# Altium schematic sheet PoE_Si3404.SchDoc: =project_title (part 3 of 3)
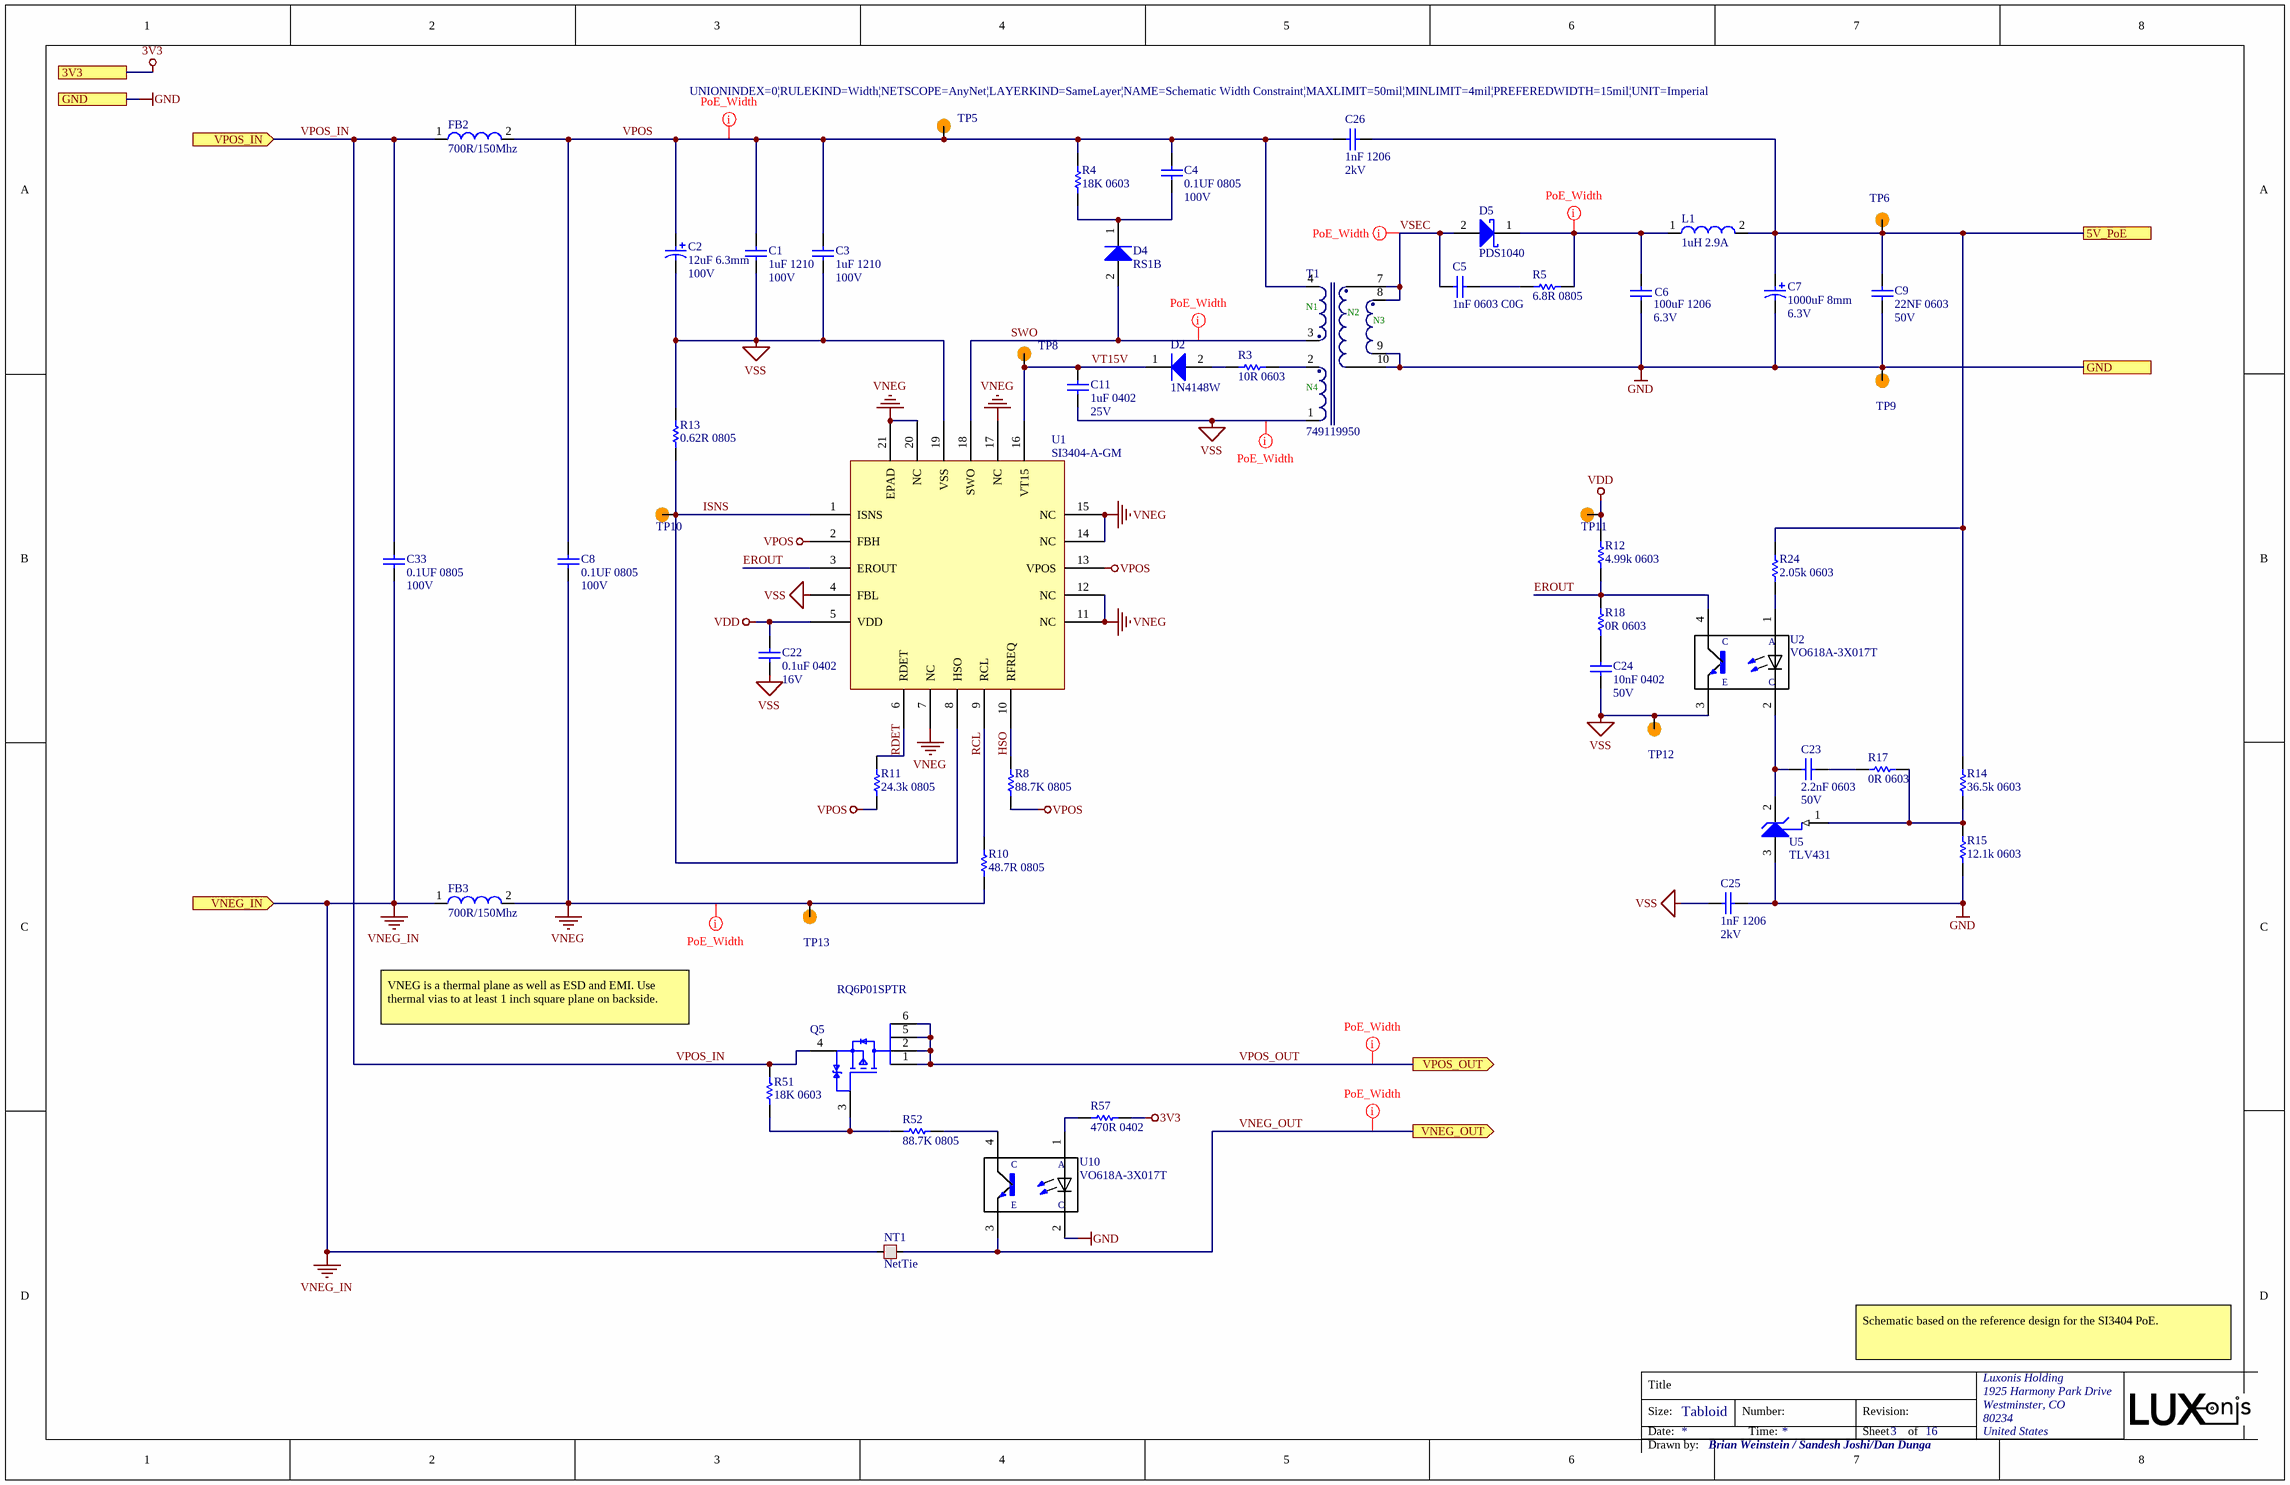
[diagram p2: PoE_Si3404.SchDoc]

## Library data of the parts (continued)
R11 = CRCW080524K3FKEA: RES SMD 24.3K OHM 1% 1/8W 0805; Manufacturer 1: Vishay; Resistance: 24.3kR; Temperature Coefficient: 100ppm/°C; Power Rating: 125mW; Voltage Rating: 150V; Supplier 1: Digi-Key; Manufacturer Part Number 1: CRCW080524K3FKEA; Stock 1: 7150; Pricing 1: 1=0.10000, 10=0.06200, 100=0.02540, 1000=0.01142, 2500=0.00991 (USD); RoHS: Yes; Mount: Surface Mount; Case/Package: 0805; Number of Pins: 2; Weight: 0.000194oz; Contact Plating: Tin; Case Code (Imperial): 0805; Case Code (Metric): 2012; Min Operating Temperature: -55°C; Max Operating Temperature: 155°C; Tolerance: 1%; Packaging: Tape and Reel; Composition: Thick Film; Package Quantity: 10; Termination: SMD/SMT; Number of Terminations: 2; Max Power Dissipation: 125mW; Features: Automotive AEC-Q200; Military Standard: Not; Voltage Rating (DC): 150V; Working Voltage: 150V; Length: 2mm; Height: 0.45mm; Width: 1.25mm; Depth: 1.25mm; Radiation Hardening: No; Lead Free: Lead Free; REACH SVHC: Unknown; ComponentLink1URL: https://datasheet.ciiva.com/11811/0900766b80d98b26-11811485.pdf?src-supplier=RSComponents; ComponentLink1Description: https://datasheet.ciiva.com/11811/0900766b80d98b26-11811485.pdf?src-supplier=RSComponents; ComponentLink2URL: https://datasheet.ciiva.com/5544/dcrcwe3-109170-5544277.pdf?src-supplier=Mouser; ComponentLink2Description: https://datasheet.ciiva.com/5544/dcrcwe3-109170-5544277.pdf?src-supplier=Mouser; ComponentLink3URL: https://datasheet.ciiva.com/2467/dcrcwe3-2467350.pdf?src-supplier=Digi-Key; ComponentLink3Description: https://datasheet.ciiva.com/2467/dcrcwe3-2467350.pdf?src-supplier=Digi-Key; ComponentLink4URL: https://datasheet.ciiva.com/3258/dcrcwe3-3258365.pdf?src-supplier=Avnet; ComponentLink4Description: https://datasheet.ciiva.com/3258/dcrcwe3-3258365.pdf?src-supplier=Avnet; ComponentLink5URL: https://datasheet.ciiva.com/2467/dcrcwe3-2467351.pdf?src-supplier=Digi-Key; ComponentLink5Description: https://datasheet.ciiva.com/2467/dcrcwe3-2467351.pdf?src-supplier=Digi-Key; ComponentLink6URL: https://datasheet.ciiva.com/2467/dcrcwe3-2467352.pdf?src-supplier=Digi-Key; ComponentLink6Description: https://datasheet.ciiva.com/2467/dcrcwe3-2467352.pdf?src-supplier=Digi-Key; ComponentLink7URL: https://datasheet.ciiva.com/22872/70201119-22872331.pdf?src-supplier=Allied+Electronics; ComponentLink7Description: https://datasheet.ciiva.com/22872/70201119-22872331.pdf?src-supplier=Allied+Electronics; ComponentLink8URL: https://datasheet.ciiva.com/3258/dcrcwe3-3258364.pdf?src-supplier=Avnet; ComponentLink8Description: https://datasheet.ciiva.com/3258/dcrcwe3-3258364.pdf?src-supplier=Avnet; ComponentLink9URL: https://datasheet.ciiva.com/17183/dcrcwe3-17183388.pdf?src-supplier=Avnet+Europe; ComponentLink9Description: https://datasheet.ciiva.com/17183/dcrcwe3-17183388.pdf?src-supplier=Avnet+Europe; ComponentLink10URL: https://datasheet.ciiva.com/22705/1697337-22705870.pdf?src-supplier=Element14; ComponentLink10Description: https://datasheet.ciiva.com/22705/1697337-22705870.pdf?src-supplier=Element14; ComponentLink11URL: https://datasheet.ciiva.com/16202/dcrcwe3-16202447.pdf?src-supplier=Future+Electronics; ComponentLink11Description: https://datasheet.ciiva.com/16202/dcrcwe3-16202447.pdf?src-supplier=Future+Electronics; Supplier 2: Newark; Supplier 3: Mouser; Supplier Part Number 1: 541-24.3KCCT-ND; Supplier Part Number 2: 53K0042; Supplier Part Number 3: 71-CRCW0805-24.3K-E3
R12 = RC0603FR-074K99L: RES SMD 4.99K OHM 1% 1/10W 0603; Manufacturer 1: Yageo; Resistance: 4.99kR; Temperature Coefficient: 100ppm/°C; Voltage Rating (DC): 50V; Power Rating: 100mW; Voltage Rating: 75V; Supplier 1: Digi-Key; Manufacturer Part Number 1: RC0603FR-074K99L; Stock 1: 4263956; Pricing 1: 1=0.10000, 10=0.02300, 100=0.00940, 1000=0.00421, 2500=0.00366 (USD); RoHS: Yes; Case/Package: 0603; Number of Pins: 2; Weight: 7.1E-05oz; Case Code (Imperial): 0603; Case Code (Metric): 1608; Min Operating Temperature: -55°C; Max Operating Temperature: 155°C; Tolerance: 1%; Packaging: Tape and Reel; Composition: Thick Film; Package Quantity: 1; Termination: SMD/SMT; Number of Terminations: 2; Military Standard: Not; Max Power Dissipation: 100mW; Features: Moisture Resistant; Length: 1.6mm; Height: 0.45mm; Width: 0.8mm; Depth: 0.8mm; Lead Free: Lead Free; REACH SVHC: Unknown; ComponentLink1URL: https://datasheet.ciiva.com/22747/443971-22747529.pdf?src-supplier=Element14; ComponentLink1Description: https://datasheet.ciiva.com/22747/443971-22747529.pdf?src-supplier=Element14; ComponentLink2URL: https://datasheet.ciiva.com/2453/pyu-r-int-thick-7-2453979.pdf?src-supplier=Digi-Key; ComponentLink2Description: https://datasheet.ciiva.com/2453/pyu-r-int-thick-7-2453979.pdf?src-supplier=Digi-Key; ComponentLink3URL: https://datasheet.ciiva.com/2453/pyu-r-int-thick-7-2453980.pdf?src-supplier=Digi-Key; ComponentLink3Description: https://datasheet.ciiva.com/2453/pyu-r-int-thick-7-2453980.pdf?src-supplier=Digi-Key; ComponentLink4URL: https://datasheet.ciiva.com/2453/pyu-r-int-thick-7-2453981.pdf?src-supplier=Digi-Key; ComponentLink4Description: https://datasheet.ciiva.com/2453/pyu-r-int-thick-7-2453981.pdf?src-supplier=Digi-Key; ComponentLink5URL: https://datasheet.ciiva.com/7983/443971-7983646.pdf?src-supplier=Element14; ComponentLink5Description: https://datasheet.ciiva.com/7983/443971-7983646.pdf?src-supplier=Element14; Supplier 2: Newark; Supplier 3: Mouser; Supplier Part Number 2: 66R2367; Supplier Part Number 1: 311-4.99KHRCT-ND; Supplier Part Number 3: 603-RC0603FR-074K99L
R13 = RL0805FR-070R62L: RES SMD 620 MOHM 1% 1/8W 0805; Manufacturer 1: Yageo; Resistance: 620mR; Power Rating: 125mW; Temperature Coefficient: 200ppm/°C; Voltage Rating (DC): 300V; Supplier 1: Digi-Key; Manufacturer Part Number 1: RL0805FR-070R62L; Stock 1: 16217; Pricing 1: 1=0.33000, 10=0.28200, 100=0.11030, 1000=0.04619, 2500=0.04234 (USD); RoHS: Yes; Case/Package: 0805; Weight: 0.000194oz; Case Code (Metric): 2012; Case Code (Imperial): 0805; Contact Plating: Tin,Matte; Min Operating Temperature: -55°C; Max Operating Temperature: 125°C; Packaging: Tape and Reel; Tolerance: 1%; Package Quantity: 1; Composition: Thick Film; Termination: SMD/SMT; Number of Terminations: 2; Max Power Dissipation: 125mW; Features: Moisture Resistant; Length: 0.079inch; Height: 0.024inch; Width: 0.049inch; Radiation Hardening: No; Lead Free: Lead Free; ComponentLink1URL: https://datasheet.ciiva.com/15328/pyu-rl-521-rohs-l-5-15328303.pdf?src-supplier=Mouser; ComponentLink1Description: https://datasheet.ciiva.com/15328/pyu-rl-521-rohs-l-5-15328303.pdf?src-supplier=Mouser; Supplier 2: Mouser; Supplier 3: Future Electronics; Supplier Part Number 1: 311-.62SCT-ND; Supplier Part Number 2: 603-RL0805FR-070R62L; Supplier Part Number 3: RL0805FR-070R62L-CUTT
R14 = RC0603FR-0736K5L: RES SMD 36.5K OHM 1% 1/10W 0603; Manufacturer 1: Yageo; Resistance: 36.5kR; Power Rating: 100mW; Voltage Rating: 50V; Temperature Coefficient: 100ppm/°C; Working Voltage: 75V; Supplier 1: Digi-Key; Manufacturer Part Number 1: RC0603FR-0736K5L; Stock 1: 763857; Pricing 1: 1=0.10000, 10=0.02300, 100=0.00940, 1000=0.00421, 2500=0.00366 (USD); RoHS: Yes; Case/Package: 0603; Case Code (Metric): 1608; Case Code (Imperial): 0603; Min Operating Temperature: -55°C; Max Operating Temperature: 155°C; Package Quantity: 1; Tolerance: 1%; Packaging: Tape and Reel; Composition: Thick Film; Number of Terminations: 2; Termination: SMD/SMT; Military Standard: Not; Max Power Dissipation: 100mW; Voltage Rating (DC): 50V; Features: Moisture Resistant; Length: 0.063inch; Height: 0.022inch; Width: 0.031inch; Depth: 0.8mm; Lead Free: Lead Free; ComponentLink1URL: https://datasheet.ciiva.com/2491/pyu-r-int-thick-7-2491306.pdf?src-supplier=Digi-Key; ComponentLink1Description: https://datasheet.ciiva.com/2491/pyu-r-int-thick-7-2491306.pdf?src-supplier=Digi-Key; ComponentLink2URL: https://datasheet.ciiva.com/2491/pyu-r-int-thick-7-2491307.pdf?src-supplier=Digi-Key; ComponentLink2Description: https://datasheet.ciiva.com/2491/pyu-r-int-thick-7-2491307.pdf?src-supplier=Digi-Key; ComponentLink3URL: https://datasheet.ciiva.com/2491/pyu-r-int-thick-7-2491308.pdf?src-supplier=Digi-Key; ComponentLink3Description: https://datasheet.ciiva.com/2491/pyu-r-int-thick-7-2491308.pdf?src-supplier=Digi-Key; Supplier 2: Mouser; Supplier 3: Future Electronics; Supplier Part Number 1: 311-36.5KHRCT-ND; Supplier Part Number 2: 603-RC0603FR-0736K5L; Supplier Part Number 3: RC0603FR-0736K5L-CUTT
R15 = RC0603FR-0712K1L: RES SMD 12.1K OHM 1% 1/10W 0603; Manufacturer 1: Yageo; Power Rating: 100mW; Temperature Coefficient: 100ppm/°C; Resistance: 12.1kR; Voltage Rating: 50V; Supplier 1: Digi-Key; Manufacturer Part Number 1: RC0603FR-0712K1L; Stock 1: 267774; Pricing 1: 1=0.10000, 10=0.02300, 100=0.00940, 1000=0.00421, 2500=0.00366 (USD); RoHS: Yes; Case/Package: 0603; Number of Pins: 2; Case Code (Metric): 1608; Case Code (Imperial): 0603; Min Operating Temperature: -55°C; Max Operating Temperature: 155°C; Tolerance: 1%; Package Quantity: 1; Packaging: Tape and Reel; Composition: Thick Film; Number of Terminations: 2; Termination: SMD/SMT; Military Standard: Not; Max Power Dissipation: 100mW; Voltage Rating (DC): 50V; Features: Moisture Resistant; Length: 1.6mm; Height: 0.022inch; Depth: 0.8mm; Width: 0.031inch; REACH SVHC: No SVHC; Lead Free: Lead Free; ComponentLink1URL: https://datasheet.ciiva.com/2519/pyu-r-int-thick-7-2519216.pdf?src-supplier=Digi-Key; ComponentLink1Description: https://datasheet.ciiva.com/2519/pyu-r-int-thick-7-2519216.pdf?src-supplier=Digi-Key; ComponentLink2URL: https://datasheet.ciiva.com/2519/pyu-r-int-thick-7-2519217.pdf?src-supplier=Digi-Key; ComponentLink2Description: https://datasheet.ciiva.com/2519/pyu-r-int-thick-7-2519217.pdf?src-supplier=Digi-Key; ComponentLink3URL: https://datasheet.ciiva.com/2519/pyu-r-int-thick-7-2519218.pdf?src-supplier=Digi-Key; ComponentLink3Description: https://datasheet.ciiva.com/2519/pyu-r-int-thick-7-2519218.pdf?src-supplier=Digi-Key; ComponentLink4URL: https://datasheet.ciiva.com/15159/getdatasheetpartid-28802-15159207.pdf?src-supplier=Verical; ComponentLink4Description: https://datasheet.ciiva.com/15159/getdatasheetpartid-28802-15159207.pdf?src-supplier=Verical; ComponentLink5URL: https://datasheet.ciiva.com/12558/rc0603-272842-12558574.pdf?src-supplier=Mouser; ComponentLink5Description: https://datasheet.ciiva.com/12558/rc0603-272842-12558574.pdf?src-supplier=Mouser; ComponentLink6URL: https://datasheet.ciiva.com/46395/443971-46395022.pdf?src-supplier=Element14; ComponentLink6Description: https://datasheet.ciiva.com/46395/443971-46395022.pdf?src-supplier=Element14; Supplier 2: Newark; Supplier 3: Mouser; Supplier Part Number 3: 603-RC0603FR-0712K1L; Supplier Part Number 2: 66R2021; Supplier Part Number 1: 311-12.1KHRCT-ND
R17 R18 = CRCW06030000Z0EA: RES SMD 0 OHM JUMPER 1/10W 0603 0 Ohms Jumper 0.1W, 1/10W Chip Resistor 0603 (1608 Metric) Automotive AEC-Q200 Thick Film; Manufacturer 1: Vishay; Manufacturer Part Number 1: CRCW0603-0000Z0EA; Resistance: 0mR; Power Rating: 100mW; Voltage Rating: 75V; Temperature Coefficient: 100ppm/°C; Tolerance: 5%; Current Rating: 2A; Supplier 1: Digi-Key; Stock 1: 742743; Pricing 1: 1=0.100000, 10=0.034000, 25=0.024400, 50=0.018600, 100=0.013800, 250=0.010480, 500=0.008400, 1000=0.006180 (USD); RoHS: Yes; Mount: Surface Mount; Case/Package: 0603; Weight: 7.1E-05oz; Contact Plating: Tin,Lead; Case Code (Metric): 1608; Case Code (Imperial): 0603; Min Operating Temperature: -55°C; Max Operating Temperature: 155°C; Composition: Thick Film; Termination: SMD/SMT; Packaging: Tape and Reel; Package Quantity: 1; Number of Terminations: 2; Military Standard: Not; Max Power Dissipation: 100mW; Voltage Rating (DC): 75V; Features: Automotive AEC-Q200; Working Voltage: 75V; Length: 1.55mm; Height: 0.02inch; Width: 0.033inch; Depth: 0.85mm; Radiation Hardening: No; Lead Free: Lead Free; REACH SVHC: Unknown; ComponentLink1URL: https://datasheet.ciiva.com/2461/dcrcwe3-2461968.pdf?src-supplier=Digi-Key; ComponentLink1Description: https://datasheet.ciiva.com/2461/dcrcwe3-2461968.pdf?src-supplier=Digi-Key; ComponentLink2URL: https://datasheet.ciiva.com/2461/dcrcwe3-2461969.pdf?src-supplier=Digi-Key; ComponentLink2Description: https://datasheet.ciiva.com/2461/dcrcwe3-2461969.pdf?src-supplier=Digi-Key; ComponentLink3URL: https://datasheet.ciiva.com/2461/dcrcwe3-2461970.pdf?src-supplier=Digi-Key; ComponentLink3Description: https://datasheet.ciiva.com/2461/dcrcwe3-2461970.pdf?src-supplier=Digi-Key; ComponentLink4URL: https://datasheet.ciiva.com/8340/dcrcwe3-8340197.pdf?src-supplier=Avnet; ComponentLink4Description: https://datasheet.ciiva.com/8340/dcrcwe3-8340197.pdf?src-supplier=Avnet; ComponentLink5URL: https://datasheet.ciiva.com/16941/dcrcw-16941302.pdf?src-supplier=Avnet+Europe; ComponentLink5Description: https://datasheet.ciiva.com/16941/dcrcw-16941302.pdf?src-supplier=Avnet+Europe; ComponentLink6URL: https://datasheet.ciiva.com/16199/dcrcwe3-16199063.pdf?src-supplier=Future+Electronics; ComponentLink6Description: https://datasheet.ciiva.com/16199/dcrcwe3-16199063.pdf?src-supplier=Future+Electronics; ComponentLink7URL: https://datasheet.ciiva.com/16725/70201119-16725175.pdf?src-supplier=Allied+Electronics; ComponentLink7Description: https://datasheet.ciiva.com/16725/70201119-16725175.pdf?src-supplier=Allied+Electronics; ComponentLink8URL: https://datasheet.ciiva.com/26316/fld-crcw-e3-data-en-26316615.pdf?src-supplier=Distrelec; ComponentLink8Description: https://datasheet.ciiva.com/26316/fld-crcw-e3-data-en-26316615.pdf?src-supplier=Distrelec; ComponentLink9URL: https://datasheet.ciiva.com/5544/dcrcwe3-109170-5544344.pdf?src-supplier=Mouser; ComponentLink9Description: https://datasheet.ciiva.com/5544/dcrcwe3-109170-5544344.pdf?src-supplier=Mouser; ComponentLink10URL: https://datasheet.ciiva.com/7841/1720486-7841816.pdf?src-supplier=Element14; ComponentLink10Description: https://datasheet.ciiva.com/7841/1720486-7841816.pdf?src-supplier=Element14; ComponentLink11URL: https://datasheet.ciiva.com/7841/1720486-7841817.pdf?src-supplier=Element14; ComponentLink11Description: https://datasheet.ciiva.com/7841/1720486-7841817.pdf?src-supplier=Element14; ComponentLink12URL: https://datasheet.ciiva.com/7841/125364-7841818.pdf?src-supplier=Element14; ComponentLink12Description: https://datasheet.ciiva.com/7841/125364-7841818.pdf?src-supplier=Element14; ComponentLink13URL: https://datasheet.ciiva.com/16721/70201119-16721450.pdf?src-supplier=Allied+Electronics; ComponentLink13Description: https://datasheet.ciiva.com/16721/70201119-16721450.pdf?src-supplier=Allied+Electronics; Supplier Part Number 1: 541-0.0GCT-ND
R24 = RC0603FR-072K05L: RES SMD 2.05K OHM 1% 1/10W 0603; Manufacturer 1: Yageo; Resistance: 2.05kR; Power Rating: 100mW; Voltage Rating: 50V; Temperature Coefficient: 100ppm/°C; Supplier 1: Digi-Key; Manufacturer Part Number 1: RC0603FR-072K05L; Stock 1: 238970; Pricing 1: 1=0.10000, 10=0.02300, 100=0.00940, 1000=0.00421, 2500=0.00366 (USD); RoHS: Yes; Mount: Surface Mount; Case/Package: 0603; Case Code (Metric): 1608; Case Code (Imperial): 0603; Min Operating Temperature: -55°C; Max Operating Temperature: 155°C; Tolerance: 1%; Package Quantity: 1; Packaging: Tape and Reel; Composition: Thick Film; Number of Terminations: 2; Termination: SMD/SMT; Military Standard: Not; Max Power Dissipation: 100mW; Voltage Rating (DC): 50V; Features: Moisture Resistant; Length: 1.6mm; Height: 0.45mm; Width: 0.031inch; Depth: 0.8mm; Lead Free: Lead Free; ComponentLink1URL: https://datasheet.ciiva.com/11819/0900766b80f96399-11819302.pdf?src-supplier=RSComponents; ComponentLink1Description: https://datasheet.ciiva.com/11819/0900766b80f96399-11819302.pdf?src-supplier=RSComponents; ComponentLink2URL: https://datasheet.ciiva.com/2454/pyu-r-int-thick-7-2454210.pdf?src-supplier=Digi-Key; ComponentLink2Description: https://datasheet.ciiva.com/2454/pyu-r-int-thick-7-2454210.pdf?src-supplier=Digi-Key; ComponentLink3URL: https://datasheet.ciiva.com/2454/pyu-r-int-thick-7-2454211.pdf?src-supplier=Digi-Key; ComponentLink3Description: https://datasheet.ciiva.com/2454/pyu-r-int-thick-7-2454211.pdf?src-supplier=Digi-Key; ComponentLink4URL: https://datasheet.ciiva.com/2454/pyu-r-int-thick-7-2454212.pdf?src-supplier=Digi-Key; ComponentLink4Description: https://datasheet.ciiva.com/2454/pyu-r-int-thick-7-2454212.pdf?src-supplier=Digi-Key; Supplier 2: Mouser; Supplier 3: Future Electronics; Supplier Part Number 1: 311-2.05KHRCT-ND; Supplier Part Number 2: 603-RC0603FR-072K05L; Supplier Part Number 3: RC0603FR-072K05L-CUTT
R57 = CRCW0402470RFKED: RES SMD 470 OHM 1% 1/16W 0402; Manufacturer 1: Vishay; Temperature Coefficient: 100ppm/°C; Power Rating: 63mW; Voltage Rating: 50V; Supplier 1: Digi-Key; Manufacturer Part Number 1: CRCW0402470RFKED; Stock 1: 9199; Pricing 1: 1=0.10000, 10=0.03800, 100=0.01540, 1000=0.00690, 2500=0.00599, 5000=0.00495 (USD); RoHS: Yes; Case/Package: 0402; Weight: 2.3E-05oz; Case Code (Imperial): 0402; Case Code (Metric): 1005; Min Operating Temperature: -55°C; Max Operating Temperature: 155°C; Packaging: Tape and Reel; Resistance: 470R; Tolerance: 1%; Composition: Thick Film; Voltage Rating (DC): 50V; Termination: SMD/SMT; Military Standard: Not; Length: 1mm; Height: 0.35mm; Width: 0.5mm; Depth: 0.5mm; Lead Free: Lead Free; ComponentLink1URL: https://datasheet.ciiva.com/11811/0900766b80d98824-11811416.pdf?src-supplier=RSComponents; ComponentLink1Description: https://datasheet.ciiva.com/11811/0900766b80d98824-11811416.pdf?src-supplier=RSComponents; Supplier 2: Newark; Supplier Part Number 1: 541-470LCT-ND; Supplier Part Number 2: 26W9133; Mount: Surface Mount; Contact Plating: Tin; Number of Terminations: 2; Package Quantity: 10; Max Power Dissipation: 63mW; Features: Automotive AEC-Q200; Radiation Hardening: No; REACH SVHC: Unknown; ComponentLink2URL: https://datasheet.ciiva.com/16764/70201119-16764886.pdf?src-supplier=Allied+Electronics; ComponentLink2Description: https://datasheet.ciiva.com/16764/70201119-16764886.pdf?src-supplier=Allied+Electronics; ComponentLink3URL: https://datasheet.ciiva.com/28613/1720486-28613479.pdf?src-supplier=Element14; ComponentLink3Description: https://datasheet.ciiva.com/28613/1720486-28613479.pdf?src-supplier=Element14; ComponentLink4URL: https://datasheet.ciiva.com/3256/dcrcwe3-3256553.pdf?src-supplier=Avnet; ComponentLink4Description: https://datasheet.ciiva.com/3256/dcrcwe3-3256553.pdf?src-supplier=Avnet; ComponentLink5URL: https://datasheet.ciiva.com/7777/1720486-7777243.pdf?src-supplier=Element14; ComponentLink5Description: https://datasheet.ciiva.com/7777/1720486-7777243.pdf?src-supplier=Element14; ComponentLink6URL: https://datasheet.ciiva.com/8336/dcrcwe3-8336715.pdf?src-supplier=Avnet; ComponentLink6Description: https://datasheet.ciiva.com/8336/dcrcwe3-8336715.pdf?src-supplier=Avnet; ComponentLink7URL: https://datasheet.ciiva.com/7777/1697337-7777244.pdf?src-supplier=Element14; ComponentLink7Description: https://datasheet.ciiva.com/7777/1697337-7777244.pdf?src-supplier=Element14; ComponentLink8URL: https://datasheet.ciiva.com/2463/dcrcwe3-2463085.pdf?src-supplier=Digi-Key; ComponentLink8Description: https://datasheet.ciiva.com/2463/dcrcwe3-2463085.pdf?src-supplier=Digi-Key; ComponentLink9URL: https://datasheet.ciiva.com/16362/dcrcwe3-16362109.pdf?src-supplier=Future+Electronics; ComponentLink9Description: https://datasheet.ciiva.com/16362/dcrcwe3-16362109.pdf?src-supplier=Future+Electronics; ComponentLink10URL: https://datasheet.ciiva.com/16882/dcrcwe3-16882493.pdf?src-supplier=Avnet+Europe; ComponentLink10Description: https://datasheet.ciiva.com/16882/dcrcwe3-16882493.pdf?src-supplier=Avnet+Europe; ComponentLink11URL: https://datasheet.ciiva.com/2463/dcrcwe3-2463086.pdf?src-supplier=Digi-Key; ComponentLink11Description: https://datasheet.ciiva.com/2463/dcrcwe3-2463086.pdf?src-supplier=Digi-Key; ComponentLink12URL: https://datasheet.ciiva.com/2463/dcrcwe3-2463087.pdf?src-supplier=Digi-Key; ComponentLink12Description: https://datasheet.ciiva.com/2463/dcrcwe3-2463087.pdf?src-supplier=Digi-Key
T1 = 749119950: TRANS FLYBACK POE 127UH SMD; Manufacturer 1: Wurth Electronics; Current Rating: 1.3A; Power Rating: 13W; Max Input Voltage: 57V; Min Input Voltage: 36V; Output Voltage: 5V; Frequency: 500kHz; ComponentLink2URL: http://www.we-online.de/katalog/media/pdf/749119950.pdf; ComponentLink2Description: Datasheet; ComponentLink1Description: Manufacturer URL; ComponentLink1URL: http://www.we-online.com; Supplier 1: Digi-Key; Manufacturer Part Number 1: 749119950; Stock 1: 148; Pricing 1: 1=5.64000, 10=5.44300, 50=5.14100, 100=4.83800 (USD); RoHS: Yes; Mount: Surface Mount; Case/Package: SMD/SMT; Min Operating Temperature: -40°C; Max Operating Temperature: 125°C; Package Quantity: 1; Packaging: Tape and Reel; Inductance: 127uH; Length: 13.5mm; Height: 12.5mm; Width: 17.75mm; Height - Seated (Max): 12.5mm; REACH SVHC: No SVHC; ComponentLink3URL: https://datasheet.ciiva.com/1378/749119950-1378246.pdf?src-supplier=Element14; ComponentLink3Description: https://datasheet.ciiva.com/1378/749119950-1378246.pdf?src-supplier=Element14; ComponentLink4URL: https://datasheet.ciiva.com/5309/749119950-91646-5309801.pdf?src-supplier=Mouser; ComponentLink4Description: https://datasheet.ciiva.com/5309/749119950-91646-5309801.pdf?src-supplier=Mouser; ComponentLink5URL: https://datasheet.ciiva.com/1386/749119950-1386647.pdf?src-supplier=Farnell; ComponentLink5Description: https://datasheet.ciiva.com/1386/749119950-1386647.pdf?src-supplier=Farnell; ComponentLink6URL: https://datasheet.ciiva.com/2940/749119950-2940138.pdf?src-supplier=Digi-Key; ComponentLink6Description: https://datasheet.ciiva.com/2940/749119950-2940138.pdf?src-supplier=Digi-Key; ComponentLink7URL: https://datasheet.ciiva.com/2940/749119950-2940139.pdf?src-supplier=Digi-Key; ComponentLink7Description: https://datasheet.ciiva.com/2940/749119950-2940139.pdf?src-supplier=Digi-Key; Supplier 2: Digi-Key; Supplier 3: Mouser; Supplier Part Number 1: 732-2432-1-ND; Supplier Part Number 2: 732-2432-6-ND; Supplier Part Number 3: 710-749119950
TP5 TP6 TP8-TP13 = TEST_POINT
U1 = SI3404-A-GM: IC POE CNTRL 1 CHANNEL 20QFN; Manufacturer 1: Silicon Labs; Supplier 1: Digi-Key; Manufacturer Part Number 1: SI3404-A-GM; Stock 1: 1481; Pricing 1: 1=1.46000, 25=1.41040, 100=1.35600, 1000=1.33340 (USD); RoHS: No; ComponentLink1URL: https://www.silabs.com/documents/public/data-sheets/si3404-datasheet.pdf?src-supplier=Digi-Key; ComponentLink1Description: https://www.silabs.com/documents/public/data-sheets/si3404-datasheet.pdf?src-supplier=Digi-Key; Supplier 2: Mouser; Supplier Part Number 1: 336-4270-ND; Supplier Part Number 2: 634-SI3404-A-GM
U2 U10 = VO618A-3X017T: OPTOISOLATOR 5.3KV TRANS 4-SMD; Manufacturer 1: Vishay Semiconductors; Max Power Dissipation: 150mW; Collector Emitter Voltage (VCEO): 80V; Collector Emitter Saturation Voltage: 400mV; Max Collector Current: 50mA; Max Input Current: 60mA; Number of Channels: 1; Reverse Breakdown Voltage: 6V; Forward Voltage: 1.1V; Current Transfer Ratio: 100%; Supplier 1: Digi-Key; Manufacturer Part Number 1: VO618A-3X017T; Stock 1: 28306; Pricing 1: 1=1.04000, 10=0.80900, 100=0.51980, 500=0.43890 (USD); RoHS: Yes; Mount: Surface Mount; Case/Package: SMD/SMT; Number of Pins: 4; Contact Plating: Tin; Min Operating Temperature: -55°C; Max Operating Temperature: 110°C; Packaging: Tape and Reel; Package Quantity: 1; Forward Current: 60mA; Max Output Voltage: 80V; Output Current per Channel: 50mA; Isolation Voltage: 5.3kV; Number of Elements: 1; Power Dissipation: 150mW; Input Current: 60mA; Radiation Hardening: No; REACH SVHC: Unknown; Lead Free: Lead Free; ComponentLink1URL: https://datasheet.ciiva.com/26183/vo618a-26183397.pdf?src-supplier=Avnet+Europe; ComponentLink1Description: https://datasheet.ciiva.com/26183/vo618a-26183397.pdf?src-supplier=Avnet+Europe; ComponentLink2URL: https://datasheet.ciiva.com/2087/vo618a-2087431.pdf?src-supplier=Digi-Key; ComponentLink2Description: https://datasheet.ciiva.com/2087/vo618a-2087431.pdf?src-supplier=Digi-Key; ComponentLink3URL: https://datasheet.ciiva.com/2087/vo618a-2087432.pdf?src-supplier=Digi-Key; ComponentLink3Description: https://datasheet.ciiva.com/2087/vo618a-2087432.pdf?src-supplier=Digi-Key; ComponentLink4URL: https://datasheet.ciiva.com/2087/vo618a-2087433.pdf?src-supplier=Digi-Key; ComponentLink4Description: https://datasheet.ciiva.com/2087/vo618a-2087433.pdf?src-supplier=Digi-Key; Supplier 2: Newark; Supplier 3: Mouser; Supplier Part Number 1: VO618A-3X017TCT-ND; Supplier Part Number 2: 48W3695; Supplier Part Number 3: 78-VO618A-3X017T
U5 = TLV431BCDBZR: IC VREF SHUNT ADJ SOT23-3; Manufacturer 1: Texas Instruments; Tolerance: 0.5%; Max Input Voltage: 7V; Output Voltage: 6V; Max Output Current: 15mA; Temperature Coefficient: 129ppm/°C; Cathode Current: 100uA; Reference Type: Shunt,Adjustable; Number of Channels: 1; Min Input Voltage: 1.24V; Supplier 1: Digi-Key; Manufacturer Part Number 1: TLV431BCDBZR; Stock 1: 3209; Pricing 1: 1=0.92000, 10=0.81200, 100=0.57850, 500=0.46772, 1000=0.35695 (USD); RoHS: Yes; Case/Package: SOT-23; Number of Pins: 3; Min Operating Temperature: -40°C; Max Operating Temperature: 125°C; Packaging: Tape and Reel; Package Quantity: 1; Output Current: 15mA; Max Output Voltage: 6V; Reference Voltage: 6V; Radiation Hardening: No; Lead Free: Lead Free; REACH SVHC: No SVHC; ComponentLink1URL: https://datasheet.ciiva.com/26889/tlv431bcdbzr-26889546.pdf?src-supplier=IIIC; ComponentLink1Description: https://datasheet.ciiva.com/26889/tlv431bcdbzr-26889546.pdf?src-supplier=IIIC; ComponentLink2URL: https://datasheet.ciiva.com/2006/tlv431a-2006546.pdf?src-supplier=Digi-Key; ComponentLink2Description: https://datasheet.ciiva.com/2006/tlv431a-2006546.pdf?src-supplier=Digi-Key; ComponentLink3URL: https://datasheet.ciiva.com/2006/tlv431a-2006547.pdf?src-supplier=Digi-Key; ComponentLink3Description: https://datasheet.ciiva.com/2006/tlv431a-2006547.pdf?src-supplier=Digi-Key; ComponentLink4URL: https://datasheet.ciiva.com/2006/tlv431a-2006548.pdf?src-supplier=Digi-Key; ComponentLink4Description: https://datasheet.ciiva.com/2006/tlv431a-2006548.pdf?src-supplier=Digi-Key; ComponentLink5URL: https://datasheet.ciiva.com/26264/tlv431b-26264234.pdf?src-supplier=Avnet+Europe; ComponentLink5Description: https://datasheet.ciiva.com/26264/tlv431b-26264234.pdf?src-supplier=Avnet+Europe; ComponentLink6URL: https://datasheet.ciiva.com/46397/1887487-46397709.pdf?src-supplier=Element14; ComponentLink6Description: https://datasheet.ciiva.com/46397/1887487-46397709.pdf?src-supplier=Element14; Supplier 2: TI store; Supplier 3: Mouser; Supplier Part Number 1: 296-17569-1-ND; Supplier Part Number 2: TLV431BCDBZR; Supplier Part Number 3: 595-TLV431BCDBZR